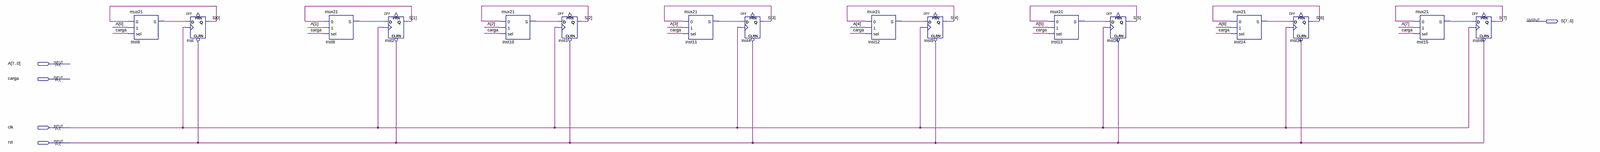
[diagram p0: schematic sheet, whole]
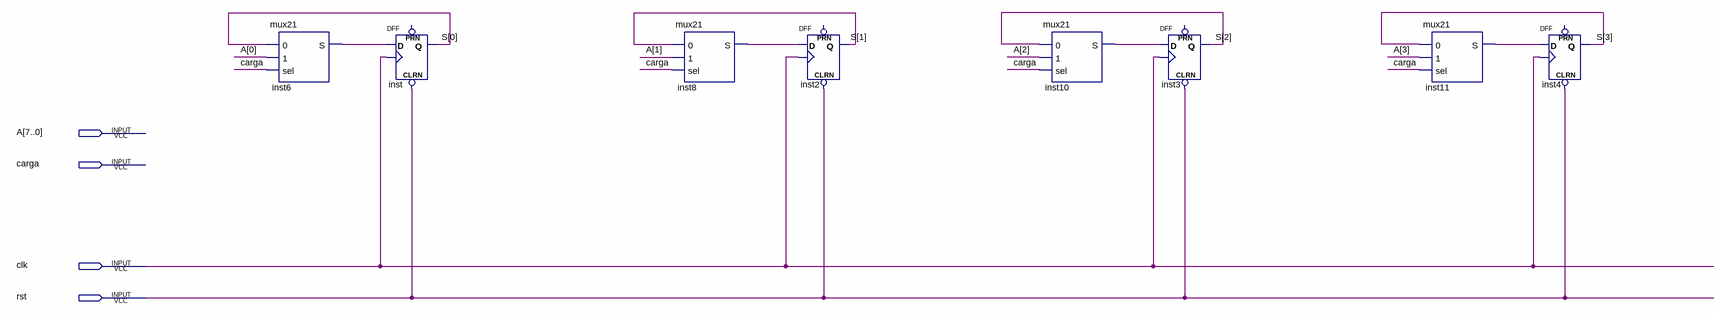
[diagram p1: schematic sheet, left part]
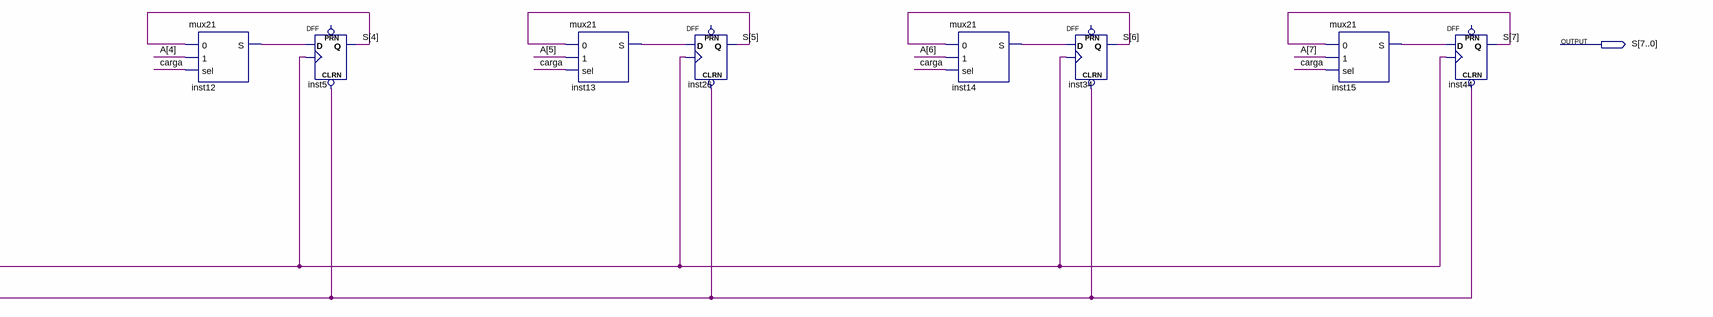
[diagram p2: schematic sheet, right part]
// Quartus schematic reg.bdf as structural Verilog: 16 symbols, 5 pins
module \reg  (
  input  [7:0] A,
  input  carga,
  input  clk,
  input  rst,
  output [7:0] S
);

  wire inst6_s, inst8_s, inst10_s, inst11_s, inst12_s, inst13_s, inst14_s, inst15_s;

  mux21 inst6 (.\0 (S[0]), .\1 (A[0]), .sel(carga), .S(inst6_s));
  DFF inst (.CLRN(rst), .CLK(clk), .D(inst6_s), .Q(S[0]));  // open: PRN
  mux21 inst8 (.\0 (S[1]), .\1 (A[1]), .sel(carga), .S(inst8_s));
  DFF inst2 (.CLRN(rst), .CLK(clk), .D(inst8_s), .Q(S[1]));  // open: PRN
  mux21 inst10 (.\0 (S[2]), .\1 (A[2]), .sel(carga), .S(inst10_s));
  DFF inst3 (.CLRN(rst), .CLK(clk), .D(inst10_s), .Q(S[2]));  // open: PRN
  mux21 inst11 (.\0 (S[3]), .\1 (A[3]), .sel(carga), .S(inst11_s));
  DFF inst4 (.CLRN(rst), .CLK(clk), .D(inst11_s), .Q(S[3]));  // open: PRN
  mux21 inst12 (.\0 (S[4]), .\1 (A[4]), .sel(carga), .S(inst12_s));
  DFF inst5 (.CLRN(rst), .CLK(clk), .D(inst12_s), .Q(S[4]));  // open: PRN
  mux21 inst13 (.\0 (S[5]), .\1 (A[5]), .sel(carga), .S(inst13_s));
  DFF inst26 (.CLRN(rst), .CLK(clk), .D(inst13_s), .Q(S[5]));  // open: PRN
  mux21 inst14 (.\0 (S[6]), .\1 (A[6]), .sel(carga), .S(inst14_s));
  DFF inst34 (.CLRN(rst), .CLK(clk), .D(inst14_s), .Q(S[6]));  // open: PRN
  mux21 inst15 (.\0 (S[7]), .\1 (A[7]), .sel(carga), .S(inst15_s));
  DFF inst44 (.CLRN(rst), .CLK(clk), .D(inst15_s), .Q(S[7]));  // open: PRN
endmodule
